# Altium schematic sheet [03] - PWR 3V3, 1V0.SchDoc
size A4; DocumentNumber: 3; SheetNumber: 3; SheetTotal: 15
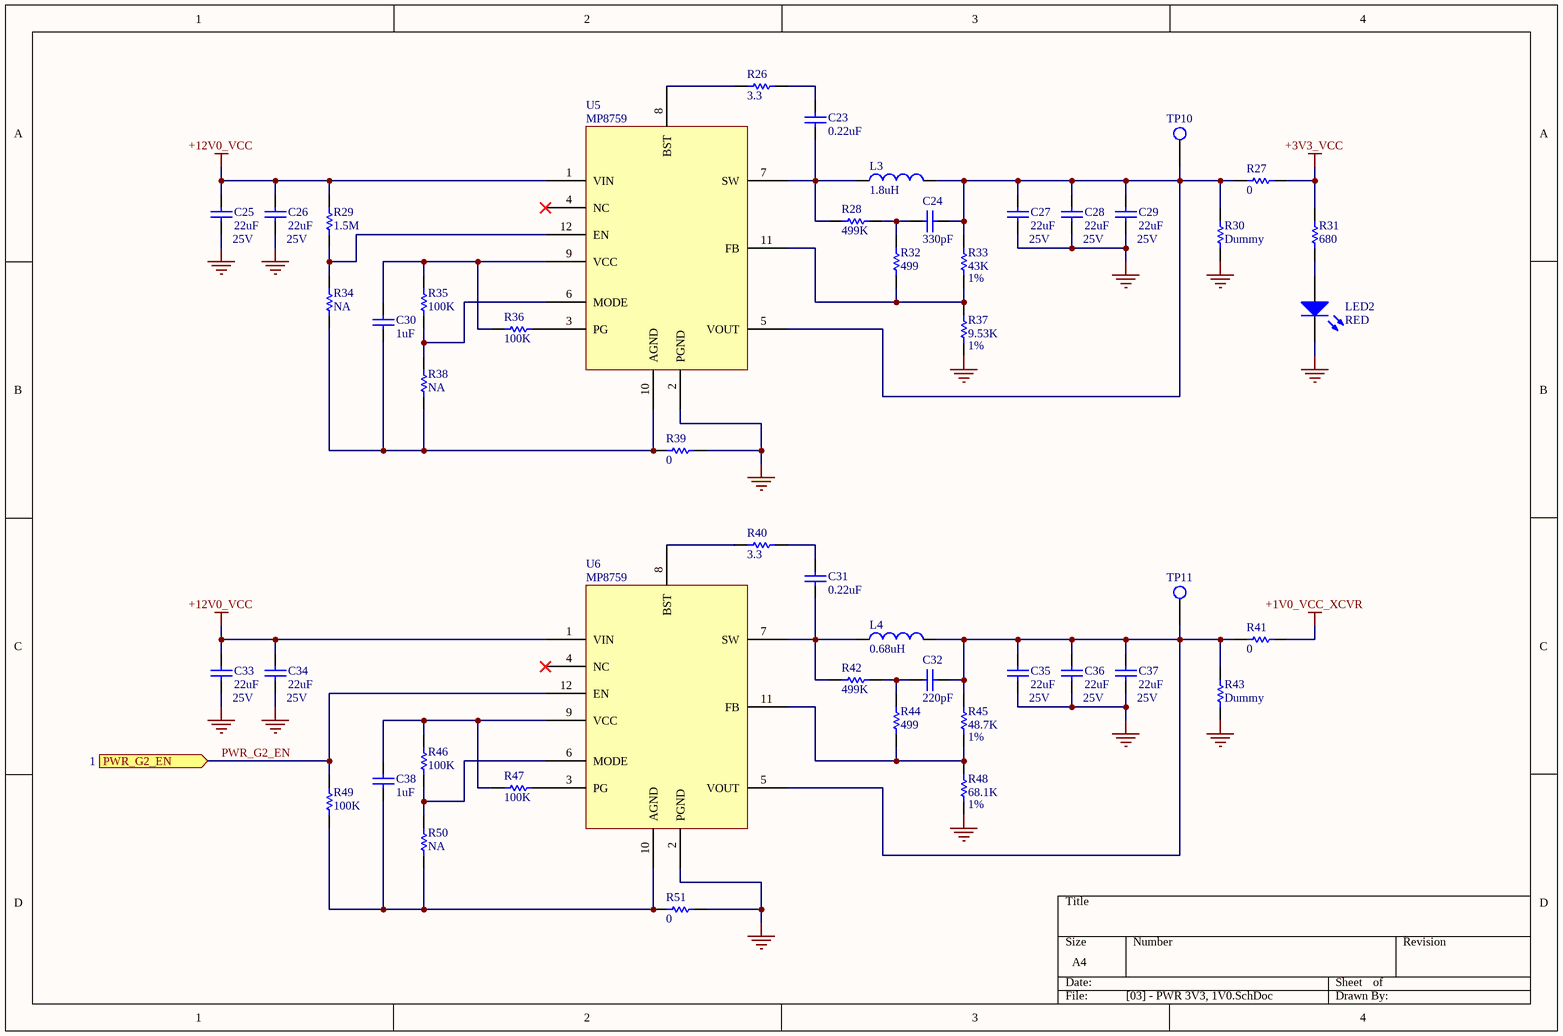
[diagram p0: [03] - PWR 3V3, 1V0.SchDoc]

## Parts
C23  0.22uF  [0402_C]
C24  330pF  [0402_C]
C25  22uF  RATED_VOLTAGE: 25V  [1210_C]
C26  22uF  RATED_VOLTAGE: 25V  [1210_C]
C27  22uF  RATED_VOLTAGE: 25V  [1210_C]
C28  22uF  RATED_VOLTAGE: 25V  [1210_C]
C29  22uF  RATED_VOLTAGE: 25V  [1210_C]
C30  1uF  [0402_C]
C31  0.22uF  [0402_C]
C32  220pF  [0402_C]
C33  22uF  RATED_VOLTAGE: 25V  [1210_C]
C34  22uF  RATED_VOLTAGE: 25V  [1210_C]
C35  22uF  RATED_VOLTAGE: 25V  [1210_C]
C36  22uF  RATED_VOLTAGE: 25V  [1210_C]
C37  22uF  RATED_VOLTAGE: 25V  [1210_C]
C38  1uF  [0402_C]
L3  1.8uH  [IHLP-4040]
L4  0.68uH  [IHLP-2525]
LED2  RED  [LED_0805]
R26  3.3  [0402_R]
R27  0  [1210_R]
R28  499K  [0402_R]
R29  1.5M  [0402_R]
R30  Dummy  [1210_R]
R31  680  [0805_R]
R32  499  [0402_R]
R33  43K  Tolerance: 1%  [0402_R]
R34  NA  [0402_R]
R35  100K  [0402_R]
R36  100K  [0402_R]
R37  9.53K  Tolerance: 1%  [0402_R]
R38  NA  [0402_R]
R39  0  [0402_R]
R40  3.3  [0402_R]
R41  0  [1210_R]
R42  499K  [0402_R]
R43  Dummy  [1210_R]
R44  499  [0402_R]
R45  48.7K  Tolerance: 1%  [0402_R]
R46  100K  [0402_R]
R47  100K  [0402_R]
R48  68.1K  Tolerance: 1%  [0402_R]
R49  100K  [0402_R]
R50  NA  [0402_R]
R51  0  [0402_R]
TP10  Test Point  [PIN_1.5mm]  (value not drawn)
TP11  Test Point  [PIN_1.5mm]  (value not drawn)
U5  MP8759
U6  MP8759

## Ports
PWR_G2_EN (in, see 1)

## Nets
+1V0_VCC_XCVR: R41.2
+3V3_VCC: R27.2 R31.2
+12V0_VCC: C25.2 C26.2 C33.2 C34.2 R29.1 U5.1(VIN) U6.1(VIN)
GND: C25.1 C26.1 C27.1 C28.1 C29.1 C33.1 C34.1 C35.1 C36.1 C37.1 LED2.2(K) R30.1 R37.1 R39.1 R43.1 R48.1 R51.1 U5.2(PGND) U6.2(PGND)
PWR_G2_EN: R49.1 U6.12(EN) ; port PWR_G2_EN
NetC23_1: C23.1 L3.1 R28.2 U5.7(SW)
NetC23_2: C23.2 R26.2
NetC24_1: C24.1 C27.2 C28.2 C29.2 L3.2 R27.1 R30.2 R33.2 TP10.1 U5.5(VOUT)
NetC24_2: C24.2 R28.1 R32.1
NetC30_1: C30.1 R34.2 R38.2 R39.2 U5.10(AGND)
NetC30_2: C30.2 R35.1 R36.2 U5.9(VCC)
NetC31_1: C31.1 L4.1 R42.2 U6.7(SW)
NetC31_2: C31.2 R40.2
NetC32_1: C32.1 C35.2 C36.2 C37.2 L4.2 R41.1 R43.2 R45.2 TP11.1 U6.5(VOUT)
NetC32_2: C32.2 R42.1 R44.1
NetC38_1: C38.1 R49.2 R50.2 R51.2 U6.10(AGND)
NetC38_2: C38.2 R46.1 R47.2 U6.9(VCC)
NetLED2_1: LED2.1(A) R31.1
NetR26_1: R26.1 U5.8(BST)
NetR29_2: R29.2 R34.1 U5.12(EN)
NetR32_2: R32.2 R33.1 R37.2 U5.11(FB)
NetR35_2: R35.2 R38.1 U5.6(MODE)
NetR36_1: R36.1 U5.3(PG)
NetR40_1: R40.1 U6.8(BST)
NetR44_2: R44.2 R45.1 R48.2 U6.11(FB)
NetR46_2: R46.2 R50.1 U6.6(MODE)
NetR47_1: R47.1 U6.3(PG)

Not connected (* = marked no-connect by the designer): U5 4(NC)*; U6 4(NC)*

## Library data of the parts
C23 C31 = Cap SMD: Non-Pol SMD Capacitor; RATED_VOLTAGE: 25V; Value: 0.22uF; Manufacturer Part Num: *; Dielectric: *
C24 C32 = Cap SMD: Non-Pol SMD Capacitor; RATED_VOLTAGE: 16V; Manufacturer Part Num: *; Dielectric: *
  C24: Value: 330pF
  C32: Value: 220pF
C25-C29 C33-C37 = Cap SMD: Non-Pol SMD Capacitor; Manufacturer Part Num: GRM32ER71E226KE15; Dielectric: X7R; Value: 22uF
C30 C38 = Cap SMD: Non-Pol SMD Capacitor; Manufacturer Part Num: GCM155C71A105ME38; RATED_VOLTAGE: 10V; Dielectric: X7S; Value: 1uF
L3 = Inductor: Inductor SMD; Manufacturer Part Num: IHLP4040DZER1R8M11; Value: 1.8uH
L4 = Inductor: Inductor SMD; Manufacturer Part Num: IHLP2525CZERR68M01; Value: 0.68uH
LED2 = LED: Typical LED; Value: RED
R26 R27 R29-R31 R34-R36 R38-R41 R43 R46 R47 R49-R51 = Res SMD: SMD Resistor; Tolerance: 5%; Manufacturer Part Num: *
  R26 R40: Value: 3.3
  R27 R39 R41 R51: Value: 0
  R29: Value: 1.5M
  R30 R43: Value: Dummy
  R31: Value: 680
  R34 R38 R50: Value: NA
  R35 R36 R46 R47 R49: Value: 100K
R28 R32 R42 R44 = Res SMD: SMD Resistor; Tolerance: 1%; Manufacturer Part Num: *
  R28 R42: Value: 499K
  R32 R44: Value: 499
R33 R37 R45 R48 = Res SMD: SMD Resistor; Manufacturer Part Num: *
  R33: Value: 43K
  R37: Value: 9.53K
  R45: Value: 48.7K
  R48: Value: 68.1K
TP10 TP11 = Test Point: Test Point Footprint; Value: Test Point
U5 U6 = MP8759: 26V, 8A, Low I Q , High-Current,  Synchronous, Step-Down Converter; Manufacturer Part Num: MP8759GD; Value: MP8759